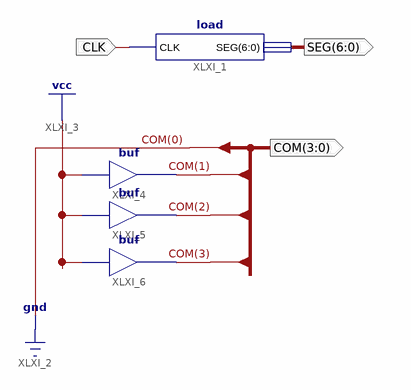
[diagram p0: schematic sheet 1]
// Xilinx ISE schematic main.sch (spartan6) as structural Verilog: 4 symbols, 3 ports
module main (
  input  CLK,
  output [6:0] SEG,
  output [3:0] COM
);

  load XLXI_1 (.CLK(CLK), .SEG(SEG));
  buf XLXI_4 (COM[1], 1'b1);
  buf XLXI_5 (COM[2], 1'b1);
  buf XLXI_6 (COM[3], 1'b1);

  assign COM[0] = 1'b0;
endmodule
